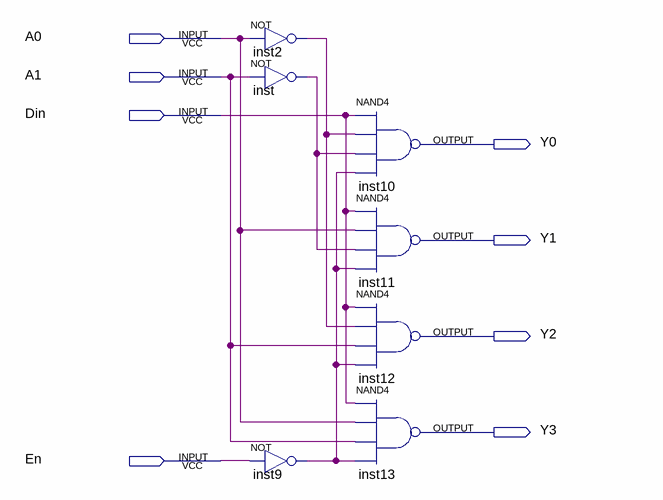
[diagram p0: schematic sheet]
// Quartus schematic test04231.bdf as structural Verilog: 7 symbols, 8 pins
module test04231 (
  input  A0,
  input  A1,
  input  Din,
  input  En,
  output Y0,
  output Y1,
  output Y2,
  output Y3
);

  wire inst2_out, inst9_out, inst_out;

  not inst2 (inst2_out, A0);
  not inst (inst_out, A1);
  not inst9 (inst9_out, En);
  nand inst10 (Y0, Din, inst2_out, inst_out, inst9_out);
  nand inst11 (Y1, Din, A0, inst_out, inst9_out);
  nand inst12 (Y2, Din, inst2_out, A1, inst9_out);
  nand inst13 (Y3, Din, A0, A1, inst9_out);
endmodule
